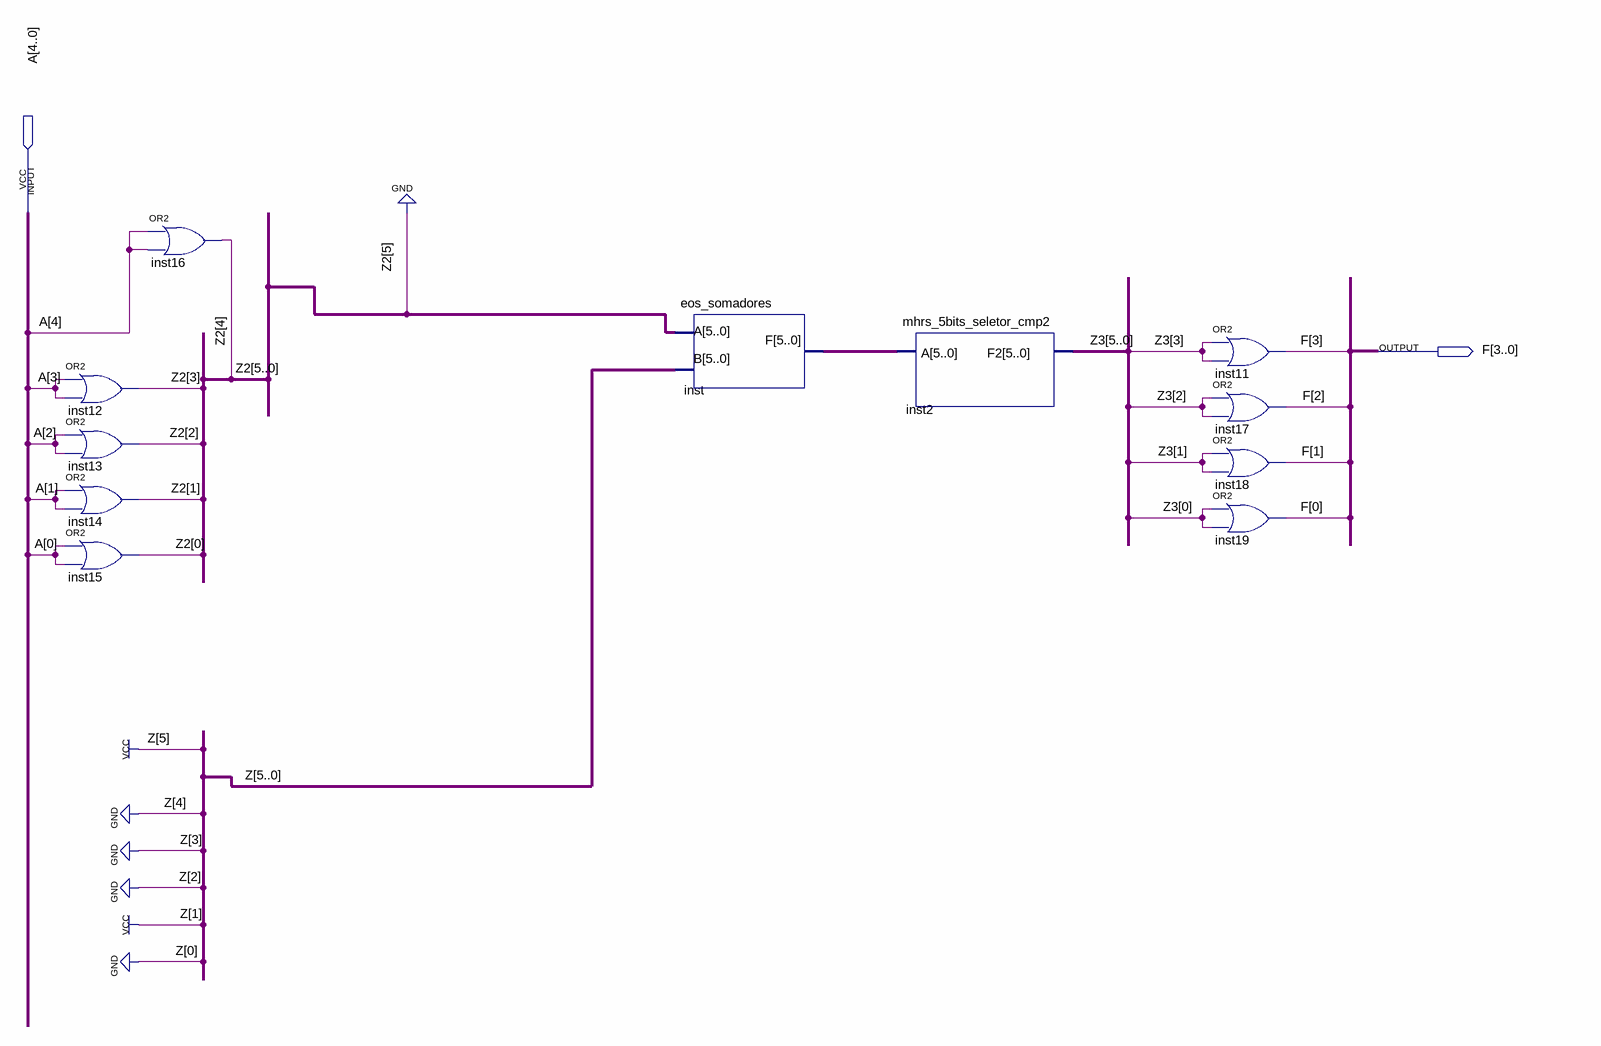
[diagram p0: schematic sheet]
// Quartus schematic mhrs_subtrator_30.bdf as structural Verilog: 11 symbols, 2 pins
module mhrs_subtrator_30 (
  input  [4:0] A,
  output [3:0] F
);

  wire [4:0] Z2;
  wire [5:0] inst_f, Z3;

  or inst12 (Z2[3], A[3], A[3]);
  or inst13 (Z2[2], A[2], A[2]);
  or inst14 (Z2[1], A[1], A[1]);
  or inst15 (Z2[0], A[0], A[0]);
  or inst16 (Z2[4], A[4], A[4]);
  eos_somadores inst (.A({1'b0, Z2}), .B(6'b100010), .F(inst_f));
  mhrs_5bits_seletor_cmp2 inst2 (.A(inst_f), .F2(Z3));
  or inst11 (F[3], Z3[3], Z3[3]);
  or inst17 (F[2], Z3[2], Z3[2]);
  or inst18 (F[1], Z3[1], Z3[1]);
  or inst19 (F[0], Z3[0], Z3[0]);
endmodule
